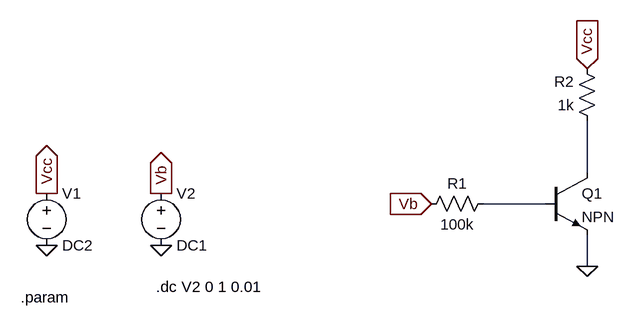
[diagram p0: schematic Draft5.asc]
Draft5.asc, the LTspice schematic file:
Version 4
SHEET 1 880 680
WIRE 256 96 256 16
WIRE 192 144 96 144
WIRE 256 240 256 192
FLAG 256 240 0
FLAG 256 -64 Vcc
IOPIN 256 -64 In
FLAG 16 144 Vb
IOPIN 16 144 In
FLAG -576 208 0
FLAG -400 208 0
FLAG -576 128 Vcc
IOPIN -576 128 Out
FLAG -400 128 Vb
IOPIN -400 128 Out
SYMBOL npn 192 96 R0
SYMATTR InstName Q1
SYMBOL res 112 128 R90
WINDOW 0 0 56 VBottom 2
WINDOW 3 32 56 VTop 2
SYMATTR InstName R1
SYMATTR Value 100k
SYMBOL res 272 32 R180
WINDOW 0 36 76 Left 2
WINDOW 3 36 40 Left 2
SYMATTR InstName R2
SYMATTR Value 1k
SYMBOL voltage -576 112 R0
WINDOW 123 0 0 Left 0
WINDOW 39 0 0 Left 0
SYMATTR InstName V1
SYMATTR Value DC2
SYMBOL voltage -400 112 R0
WINDOW 123 0 0 Left 0
WINDOW 39 0 0 Left 0
SYMATTR InstName V2
SYMATTR Value DC1
TEXT -408 272 Left 2 !.dc V2 0 1 0.01
TEXT -616 288 Left 2 !.param

The netlist it stands for:
* Draft5.asc
Q1 N001 N002 0 0 NPN
R1 N002 Vb 100k
R2 N001 Vcc 1k
V1 Vcc 0 DC2
V2 Vb 0 DC1
.model NPN NPN
.model PNP PNP
.lib standard.bjt
.dc V2 0 1 0.01
.param
.backanno
.end